# Altium schematic sheet 06_MODEM.SchDoc
size A3; SheetNumber: 6
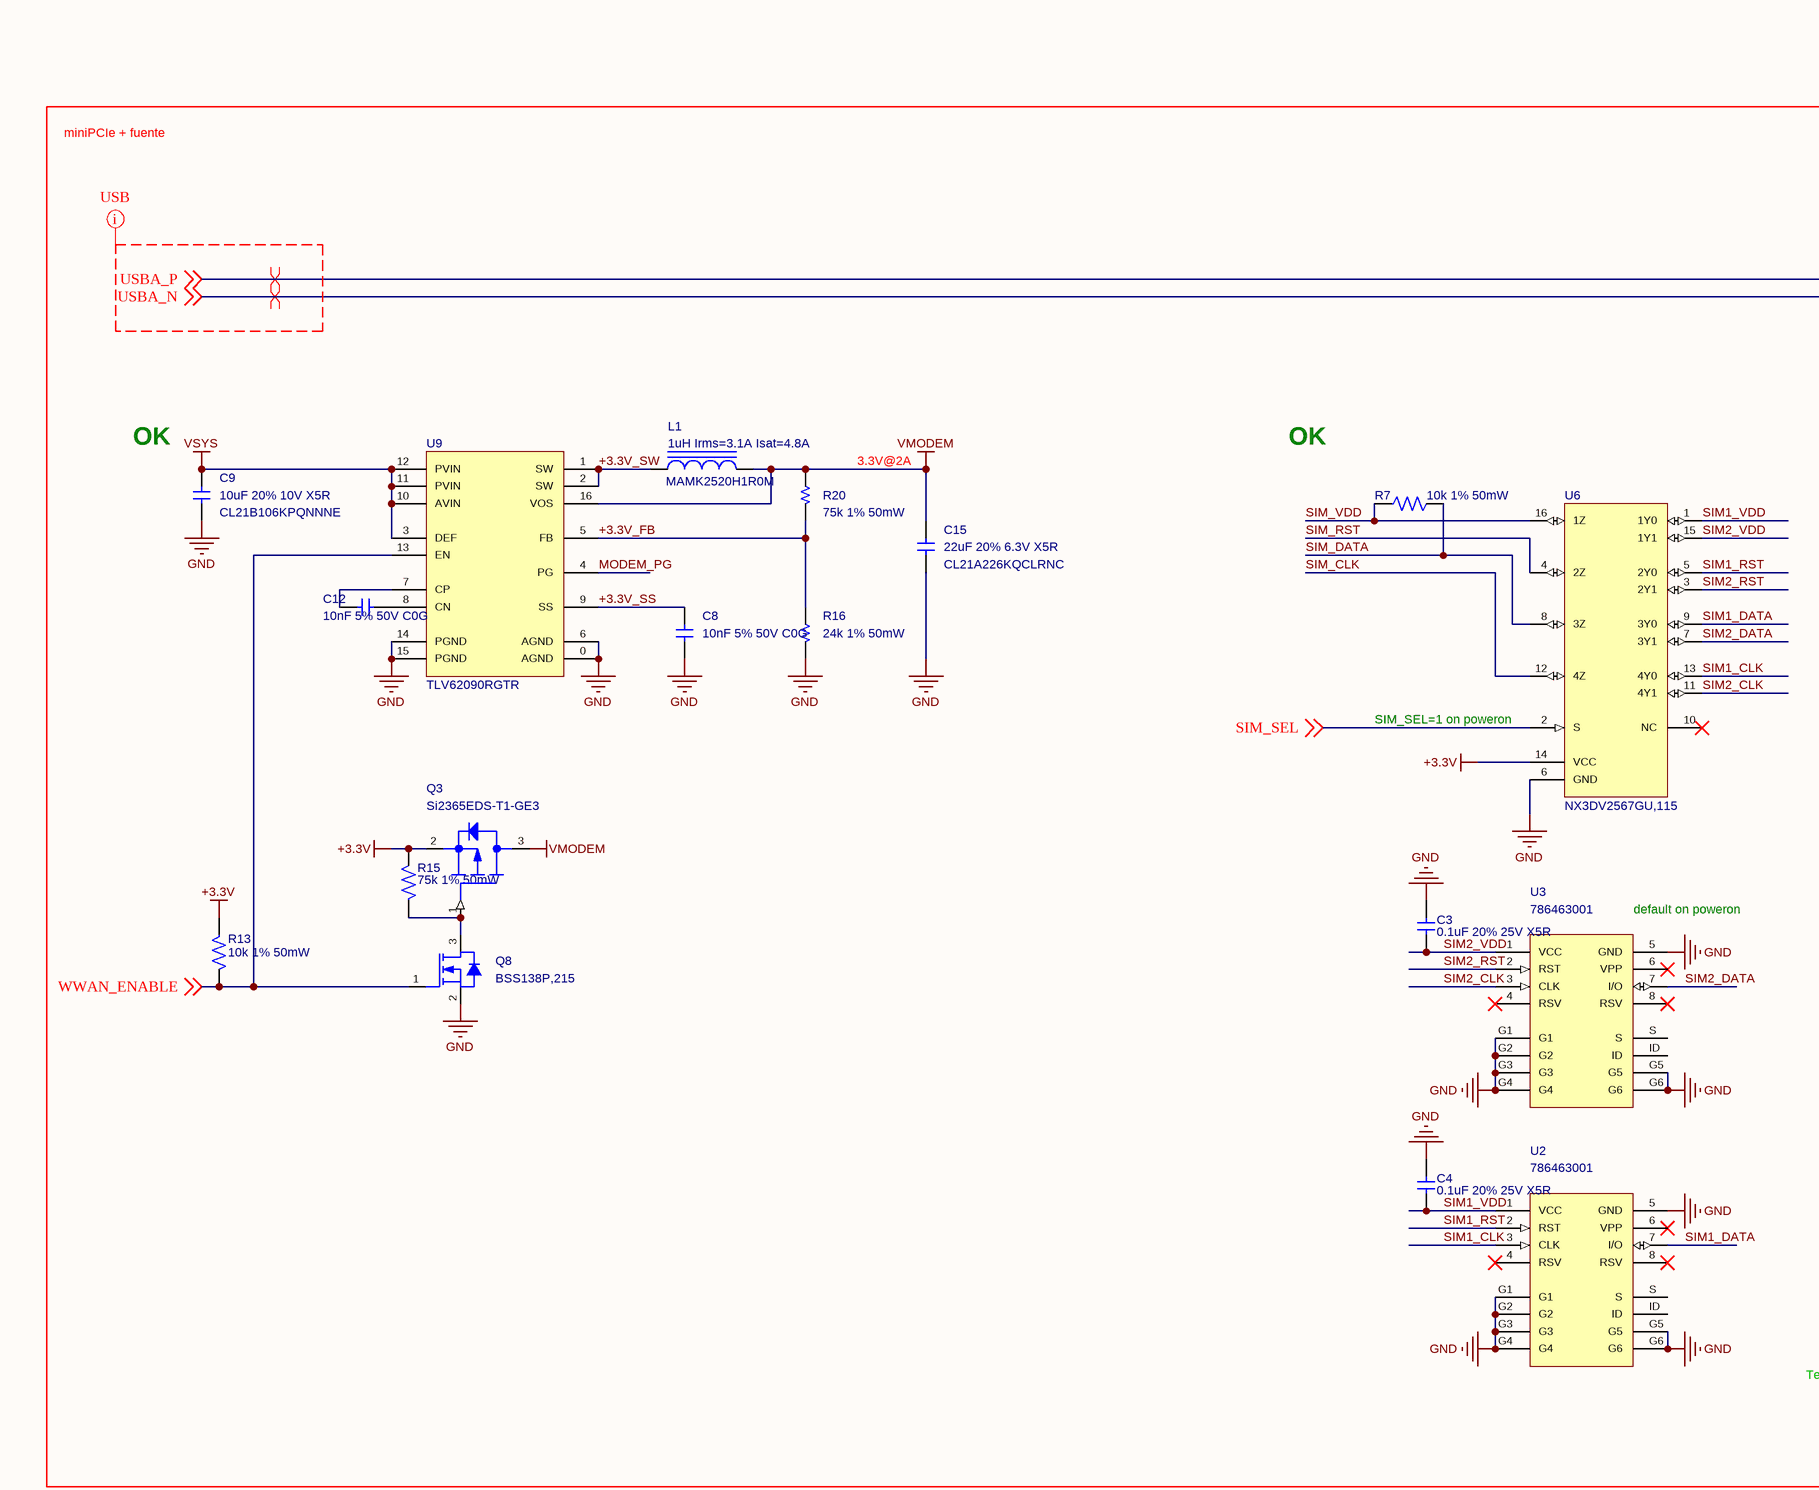
[diagram p0: 06_MODEM.SchDoc, left]
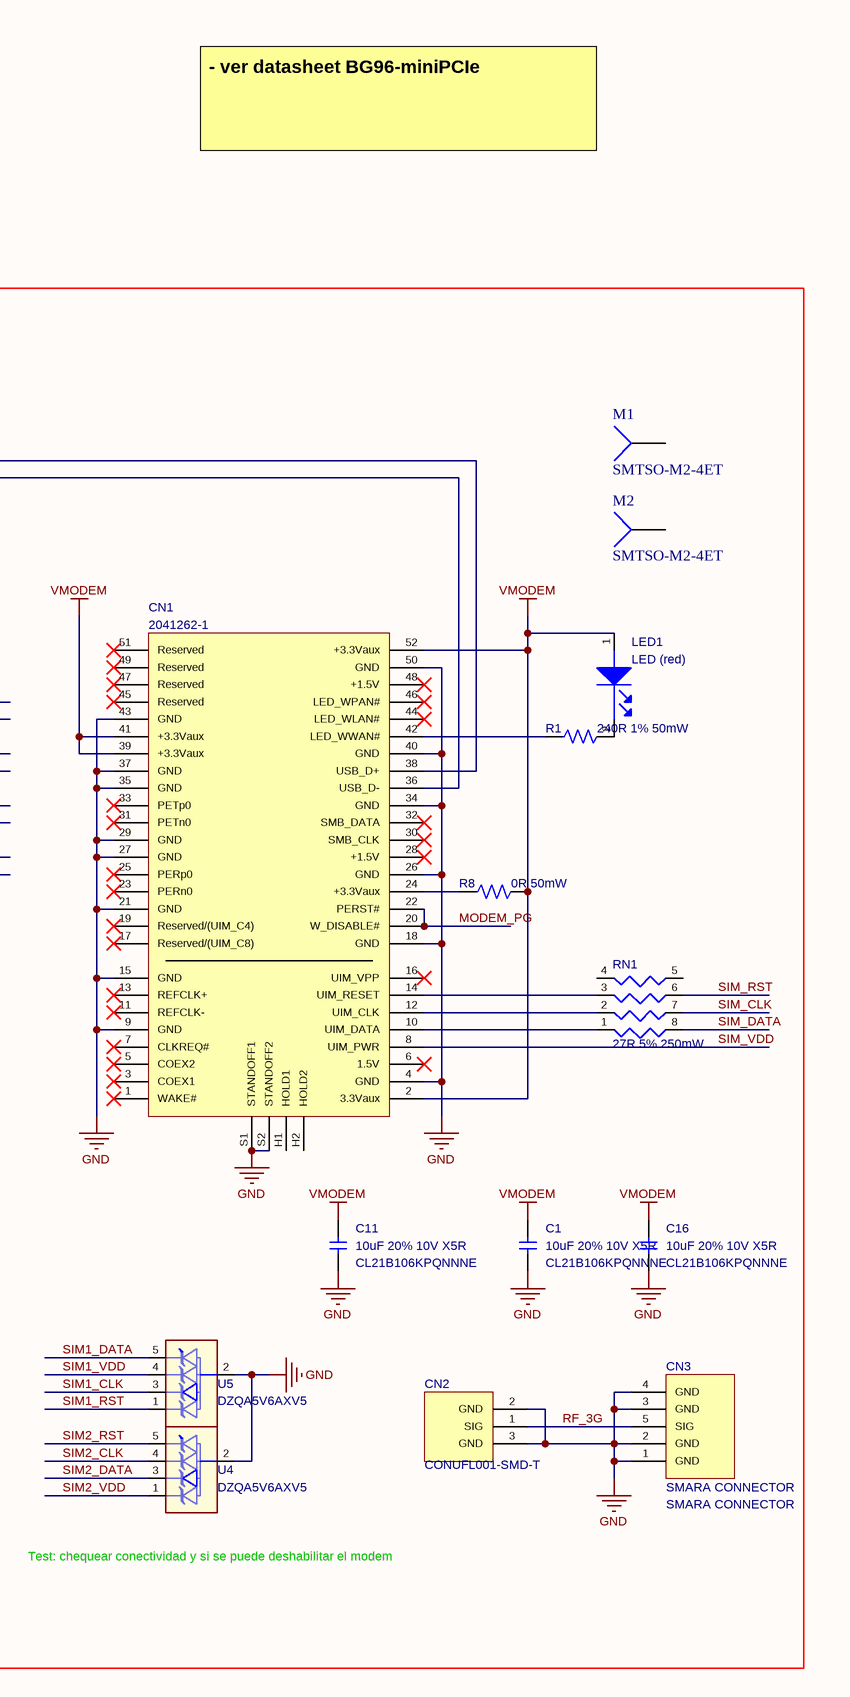
[diagram p1: 06_MODEM.SchDoc, right]

## Parts
C1  10uF 20% 10V X5R  MFG_PN: CL21B106KPQNNNE  [CAPC2012X140N]
C3  0.1uF 20% 25V X5R  [CAPC1005N]
C4  0.1uF 20% 25V X5R  [CAPC1005N]
C8  10nF 5% 50V C0G  [CAPC1005N]
C9  10uF 20% 10V X5R  MFG_PN: CL21B106KPQNNNE  [CAPC2012X140N]
C11  10uF 20% 10V X5R  MFG_PN: CL21B106KPQNNNE  [CAPC2012X140N]
C12  10nF 5% 50V C0G  [CAPC1005N]
C15  22uF 20% 6.3V X5R  MFG_PN: CL21A226KQCLRNC  [CAPC2012X140N]
C16  10uF 20% 10V X5R  MFG_PN: CL21B106KPQNNNE  [CAPC2012X140N]
CN1  2041262-1  [2041262-1]
CN2  CONUFL001-SMD-T  [U.FL-R-SMT-1]
CN3  SMARA CONNECTOR  [0733910320]
L1  1uH Irms=3.1A Isat=4.8A  MFG_PN: MAMK2520H1R0M  [INDC2520N]
LED1  LED (red)  [LEDC1608N]
M1  SMTSO-M2-4ET  (mechanical)
M2  SMTSO-M2-4ET  (mechanical)
Q3  Si2365EDS-T1-GE3  [SOT95P230X110-3N]
Q8  BSS138P,215  [SOT95P230X110-3N]
R1  240R 1% 50mW  [RESC1005X40N]
R7  10k 1% 50mW  [RESC1005X40N]
R8  0R 50mW  [RESC1005X40N]
R13  10k 1% 50mW  [RESC1005X40N]
R15  75k 1% 50mW  [RESC1005X40N]
R16  24k 1% 50mW  [RESC1005X40N]
R20  75k 1% 50mW  [RESC1005X40N]
RN1  27R 5% 250mW  [YC164]
U2  786463001  [786463001]
U3  786463001  [786463001]
U4  DZQA5V6AXV5  [SOTFL50P162X62-5N]
U5  DZQA5V6AXV5  [SOTFL50P162X62-5N]
U6  NX3DV2567GU,115  [XFQFN-16]
U9  TLV62090RGTR  [QFN50P300X300X100-17AN-2]

## Nets
+3.3V: Q3.2(SOURCE) R13.1 R15.2 U6.14(VCC)
GND: C1.2 C3.2 C4.2 C8.1 C9.2 C11.2 C15.2 C16.2 CN1.4(GND) CN1.9(GND) CN1.15(GND) CN1.18(GND) CN1.21(GND) CN1.26(GND) CN1.27(GND) CN1.29(GND) CN1.34(GND) CN1.35(GND) CN1.37(GND) CN1.40(GND) CN1.43(GND) CN1.50(GND) CN1.S1(STANDOFF1) CN1.S2(STANDOFF2) CN2.2(GND) CN2.3(GND) CN3.1(GND) CN3.2(GND) CN3.3(GND) CN3.4(GND) Q8.2(S) R16.2 U2.5(GND) U2.G1 U2.G2 U2.G3 U2.G4 U2.G5 U2.G6 U3.5(GND) U3.G1 U3.G2 U3.G3 U3.G4 U3.G5 U3.G6 U4.2 U5.2 U6.6(GND) U9.0(AGND) U9.6(AGND) U9.14(PGND) U9.15(PGND)
VMODEM: C1.1 C11.1 C15.1 C16.1 CN1.2(3.3Vaux) CN1.39(+3.3Vaux) CN1.41(+3.3Vaux) CN1.52(+3.3Vaux) L1.2 LED1.1(CATHODE) Q3.3(DRAIN) R8.2 R20.1 U9.16(VOS)
VSYS: C9.1 U9.3(DEF) U9.10(AVIN) U9.11(PVIN) U9.12(PVIN)
+3.3V_FB: R16.1 R20.2 U9.5(FB)
+3.3V_SS: C8.2 U9.9(SS)
+3.3V_SW: L1.1 U9.1(SW) U9.2(SW)
MODEM_PG: CN1.20(W_DISABLE#) CN1.22(PERST#) U9.4(PG)
RF_3G: CN2.1(SIG) CN3.5(SIG)
SIM1_CLK: U2.3(CLK) U5.3 U6.13(4Y0)
SIM1_DATA: U2.7(I/O) U5.5 U6.9(3Y0)
SIM1_RST: U2.2(RST) U5.1 U6.5(2Y0)
SIM1_VDD: C4.1 U2.1(VCC) U5.4 U6.1(1Y0)
SIM2_CLK: U3.3(CLK) U4.4 U6.11(4Y1)
SIM2_DATA: U3.7(I/O) U4.3 U6.7(3Y1)
SIM2_RST: U3.2(RST) U4.5 U6.3(2Y1)
SIM2_VDD: C3.1 U3.1(VCC) U4.1 U6.15(1Y1)
SIM_CLK: RN1.7 U6.12(4Z)
SIM_DATA: R7.2 RN1.8 U6.8(3Z)
SIM_RST: RN1.6 U6.4(2Z)
SIM_SEL: U6.2(S) ; off-sheet SIM_SEL
SIM_VDD: CN1.8(UIM_PWR) R7.1 U6.16(1Z)
USBA_N: CN1.36(USB_D-) ; off-sheet USBA_N
USBA_P: CN1.38(USB_D+) ; off-sheet USBA_P
WWAN_ENABLE: Q8.1(G) R13.2 U9.13(EN) ; off-sheet WWAN_ENABLE
NetC12_1: C12.1 U9.7(CP)
NetC12_2: C12.2 U9.8(CN)
NetCN1_10: CN1.10(UIM_DATA) RN1.1
NetCN1_12: CN1.12(UIM_CLK) RN1.2
NetCN1_14: CN1.14(UIM_RESET) RN1.3
NetCN1_24: CN1.24(+3.3Vaux) R8.1
NetCN1_42: CN1.42(LED_WWAN#) R1.1
NetLED1_2: LED1.2(ANODE) R1.2
NetQ3_1: Q3.1(GATE) Q8.3(D) R15.1

Not connected (* = marked no-connect by the designer): CN1 1(WAKE#)* 3(COEX1)* 5(COEX2)* 6(1.5V)* 7(CLKREQ#)* 11(REFCLK-)* 13(REFCLK+)* 16(UIM_VPP)* 17(Reserved/(UIM_C8))* 19(Reserved/(UIM_C4))* 23(PERn0)* 25(PERp0)* 28(+1.5V)* 30(SMB_CLK)* 31(PETn0)* 32(SMB_DATA)* 33(PETp0)* 44(LED_WLAN#)* 45(Reserved)* 46(LED_WPAN#)* 47(Reserved)* 48(+1.5V)* 49(Reserved)* 51(Reserved)* H1(HOLD1) H2(HOLD2); M1 1; M2 1; RN1 4 5; U2 4(RSV)* 6(VPP)* 8(RSV)* ID S; U3 4(RSV)* 6(VPP)* 8(RSV)* ID S; U6 10(NC)*

## Layout directives
net class USB: USBA_N, USBA_P
differential pair: USBA_N, USBA_P

## Notes on the sheet
- - ver datasheet BG96-miniPCIe
- miniPCIe + fuente
- (near C9) OK
- 3.3V@2A
- OK
- (near U6) SIM_SEL=1 on poweron
- (near U3) default on poweron
- (near U4) Test: chequear conectividad y si se puede deshabilitar el modem

## Library data of the parts
C1 C9 C11 C16 = C_Dup1: Capacitor, Ceramic; MFG: SAMSUNG; FP_DESC: C0805; Symbol Checked: Ok; Replacement Allowed: Ask; Footprint Checked: Assign OK, Footprint OK; TECHNOLOGY: X5R; TOLERANCE: 20%; VALUE: 10uF; VOLTAGE: 10V
C3 C4 = C_Dup1: Capacitor, Ceramic; MFG: SAMSUNG; MFG_PN: CL05A104KA5NNNC; FP_DESC: C0402; Symbol Checked: Ok; Replacement Allowed: Ask; Footprint Checked: Assign OK, Footprint OK; TECHNOLOGY: X5R; TOLERANCE: 20%; VALUE: 0.1uF; VOLTAGE: 25V
C8 C12 = C: Capacitor, Ceramic; MFG: <GENERIC>; Symbol Checked: Ok; FP_DESC: C0402; Replacement Allowed: Yes; Footprint Checked: Assign OK, Footprint OK; MFG_PN: <GENERIC>; Value: 10nF; TOLERANCE: 5%; VOLTAGE: 50V; TECHNOLOGY: C0G
C15 = C_Dup1: Capacitor, Ceramic; FP_DESC: C0805; MFG: SAMSUNG; Symbol Checked: Ok; Replacement Allowed: Ask; Footprint Checked: Assign OK, Footprint OK; TECHNOLOGY: X5R; TOLERANCE: 20%; VALUE: 22uF; VOLTAGE: 6.3V
CN1 = miniPCIe: PCI Express Minicard Connector; MFG: TE; Symbol Checked: Ok; Replacement Allowed: Ask; FP_DESC: miniPCIe; MFG_PN: 2041262-1; Footprint Checked: Assign OK, Footprint OK
CN2 = U.FL-R-SMT-1: Ultra Small Surface Mount Coaxial Connectors - 1.9mm or 2.4mm Mated Height; MFG: LINX; FP_DESC: U.FL connector; Symbol Checked: Ok; Replacement Allowed: Ask; MFG_PN: CONUFL001-SMD-T; Footprint Checked: Assign OK, Footprint OK
CN3 = RPSMA: SMA, Right angle; MFG: LPRS; Symbol Checked: Ok; Replacement Allowed: Ask; FP_DESC: SMA, Right angle; MFG_PN: SMARA CONNECTOR; Footprint Checked: Assign OK, Footprint OK
L1 = L_CORE: Inductor, Ferrite core; MFG: TAIYO YUDEN; Symbol Checked: Ok; FP_DESC: L1008; Replacement Allowed: No; Footprint Checked: Assign OK, Footprint OK; Value: 1uH; EXTRA_DATA: Irms=3.1A Isat=4.8A
LED1 = Led Red HSMC-C170: LED; FP_DESC: LED0603; MFG: <GENERIC>; Symbol Checked: Ok; Replacement Allowed: Yes; MFG_PN: <GENERIC>; Footprint Checked: Assign OK, Footprint OK
M1 M2 = Socket: SMT nut, M2, H=4mm; MFG: PEM; Replacement Allowed: Ask; Symbol Checked: Ok; Footprint Checked: Assign OK, Footprint OK; FP_DESC: SMT nut, M2, H=4mm; MFG_PN: SMTSO-M2-4ET
Q3 = DMG1013UW: MOSFET, P channel; MFG: VISHAY; FP_DESC: SOT23-3; Symbol Checked: Ok; Replacement Allowed: No; MFG_PN: Si2365EDS-T1-GE3; Footprint Checked: Assign OK, Footprint OK
Q8 = TRA1147: MOSFET, N channel; FP_DESC: SOT23-3; MFG: NXP; Symbol Checked: Ok; Replacement Allowed: No; Footprint Checked: Assign OK, Footprint OK; MFG_PN: BSS138P,215
R1 R7 R8 R13 R15 = R: Resistor, SMD; FP_DESC: R0402; MFG_PN: <GENERIC>; Symbol Checked: Ok; Replacement Allowed: Yes; MFG: <GENERIC>; Footprint Checked: Assign OK, Footprint OK; POWER: 50mW
  R1: TOLERANCE: 1%; VALUE: 240R
  R7 R13: TOLERANCE: 1%; VALUE: 10k
  R8: VALUE: 0R
  R15: TOLERANCE: 1%; VALUE: 75k
R16 R20 = R: Resistor, SMD; MFG: <GENERIC>; Symbol Checked: Ok; FP_DESC: R0402; Replacement Allowed: Yes; Footprint Checked: Assign OK, Footprint OK; MFG_PN: <GENERIC>; POWER: 50mW; TOLERANCE: 1%
  R16: Value: 24k
  R20: Value: 75k
RN1 = RESNW_IS_0: Resistor array; MFG: <GENERIC>; FP_DESC: Res. Pack 4x0603 Convex; Symbol Checked: Ok; Replacement Allowed: Yes; MFG_PN: <GENERIC>; Footprint Checked: Assign OK, Footprint OK; POWER: 250mW; TOLERANCE: 5%; VALUE: 27R
U2 U3 = 115I-AEAA: microSIM Card Holder; MFG: MOLEX; Symbol Checked: Ok; Replacement Allowed: Ask; FP_DESC: microSIM card holder; MFG_PN: 786463001; Footprint Checked: Assign OK, Footprint OK
U4 U5 = PESD5V0L4UG: TVS array; FP_DESC: SOT553; MFG: DIODES; Symbol Checked: Ok; Replacement Allowed: No; MFG_PN: DZQA5V6AXV5; Footprint Checked: Assign OK, Footprint OK
U6 = NX3DV2567: Low-ohmic four-pole double-throw analog switch; MFG: NXP; Symbol Checked: Ok; Replacement Allowed: No; MFG_PN: NX3DV2567GU,115; Footprint Checked: Assign OK, Footprint OK; FP_DESC: XFQFN-16
U9 = TLV62090RGTR: Buck Switching Regulator IC Positive Adjustable 0.8V 1 Output 3A 16-VFQFN Exposed Pad; MFG: TI; FP_DESC: VFQFN-16; Symbol Checked: Ok; Replacement Allowed: No; MFG_PN: TLV62090RGTR; Footprint Checked: Assign OK, Footprint OK